# EAGLE design SMD RGB COM BC639 REV5 (EAGLE 8.5.1)
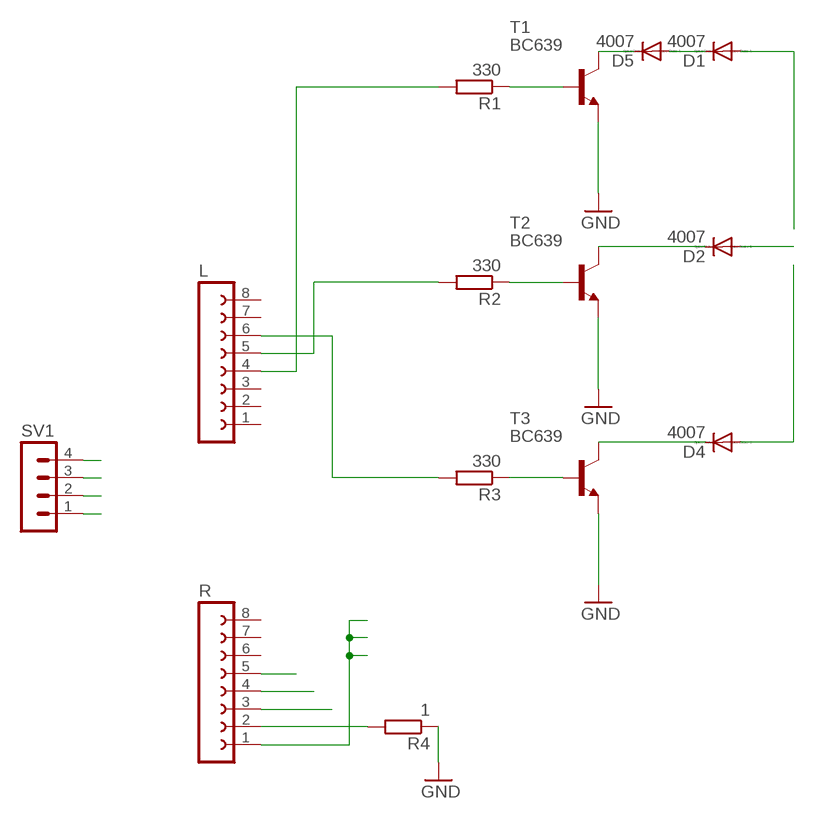
[diagram p0: schematic, sheet 1]

## Parts
D1  4007  1N4148DO35-7  [DO35-7]
D2  4007  1N4148DO35-7  [DO35-7]
D4  4007  1N4148DO35-7  [DO35-7]
D5  4007  1N4148DO35-7  [DO35-7]
L  FE08-1  [FE08]
R  FE08-1  [FE08]
R1  330  R-EU_0204/7  [0204/7]
R2  330  R-EU_0204/7  [0204/7]
R3  330  R-EU_0204/7  [0204/7]
R4  1  R-EU_0204/7  [0204/7]
SV1  MA04-1  [MA04-1]
T1  BC639  BC639-NPN-TO92-ECB  [TO92-ECB]
T2  BC639  BC639-NPN-TO92-ECB  [TO92-ECB]
T3  BC639  BC639-NPN-TO92-ECB  [TO92-ECB]

## Nets
+5V [+V]: R.1 SV1.4
BB: R3.1 T3.B
BG: R2.1 T2.B
BI: L.6 R3.2
BO [+V]: D4.A SV1.3
BR: R1.1 T1.B
GI: L.5 R2.2
GND [GND]: R4.1 T1.E T2.E T3.E
GNDIN [GND]: R4.2 R.2
GO [+V]: D2.A SV1.2
N$1: R.5
N$3: R.4
N$4: R.3
N$5 [+V]: D2.C T2.C
N$7: D1.C D5.A
N$8: D5.C T1.C
N$14 [+V]: D4.C T3.C
RI: L.4 R1.2
RO [+V]: D1.A SV1.1
Unconnected: L.1 L.2 L.3 L.7 L.8 R.6 R.7 R.8

## Library data of the parts
D1 D2 D4 D5 = diode2:1N4148: DIODE high speed (Philips)
L R = con-lsta:FE08-1: FEMALE HEADER; OC_FARNELL: unknown; OC_NEWARK: unknown
R1-R4 = rcl:R-EU_: RESISTOR, European symbol; SPICEPREFIX: R
SV1 = con-lstb:MA04-1: PIN HEADER; OC_FARNELL: unknown; OC_NEWARK: unknown
T1-T3 = transistor:*-NPN-: NPN Transistror BF959 corrected 2008.03.06

## Net classes
0 SIGNAL: width 0.61 mm, clearance 0.381 mm
1 GND: width 1.016 mm, clearance 0.254 mm
2 +V: width 1.016 mm, clearance 0.381 mm

## Board
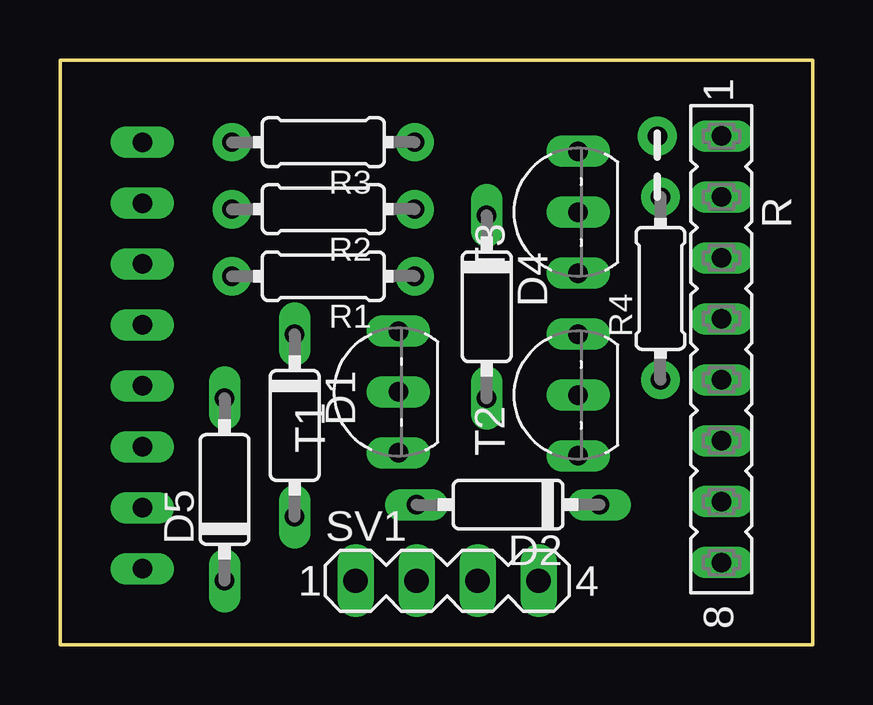
[diagram p1: board, top side]
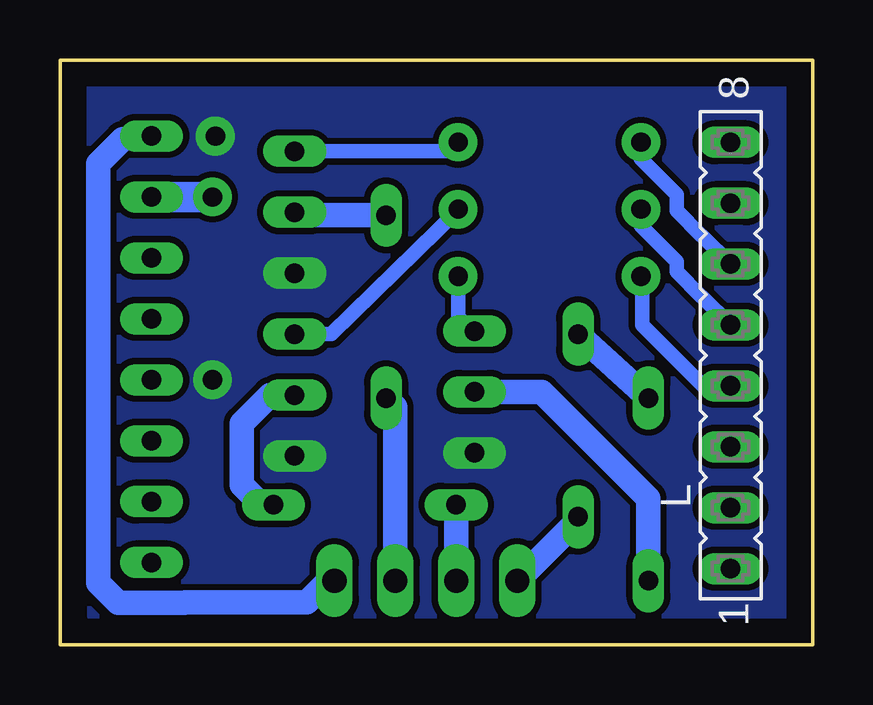
[diagram p2: board, bottom side, seen from below]

Size 31.37 x 24.38 mm. Coordinates in mm from the lower left corner, seen from the top.
Outline: 0,24.38 0,0 31.37,0 31.37,24.38 0,24.38
Copper layers (1*16): Top 0.035mm / dielectric 1.5mm / Bottom 0.035mm
Design rules "default *": minimum track width 6mil, minimum drill 0.35mm, track to track 8mil, track to pad 8mil, pad to pad 8mil, via to via 8mil, smd to smd 8mil, copper to edge 40mil, drill to drill 8mil, minimum pad ring 10mil, minimum via ring 8mil, stop-mask expansion 4mil, vias tented up to drill 0mil, thermal gap 10mil

### Footprints (pad centres in the part's own frame; a part is rotated, then mirrored left to right if it is on the bottom)
DO35-7 = drill 0.813 long: A 3.81,0; C -3.81,0
FE08 = drill 0.813 long: 1 -8.89,0; 2 -6.35,0; 3 -3.81,0; 4 -1.27,0; 5 1.27,0; 6 3.81,0; 7 6.35,0; 8 8.89,0
0204/7 = drill 0.8 pad 1.6: 1 -3.81,0; 2 3.81,0
MA04-1 = drill 1.016 long: 1 -3.81,0; 2 -1.27,0; 3 1.27,0; 4 3.81,0
TO92-ECB = drill 0.813 long: B 2.54,0; C 0,0; E -2.54,0

### Placement (x,y rotation side)
D1  9.78,9.14 270 top
D2  18.67,5.84 180 top
D4  17.78,14.1 270 top
D5  6.86,6.48 90 top
L  3.43,12.06 90 bottom
R  27.56,12.32 270 top
R1  10.97,15.37 180 top
R2  10.97,18.16 180 top
R3  10.97,20.95 180 top
R4  25.02,14.86 90 top
SV1  16.13,2.67 0 top
T1  14.1,10.54 90 top
T2  21.59,10.41 90 top
T3  21.59,18.03 90 top

### Tracks (layer width: path | path; a pad name or v marks a point on that pad's centre or on a via)
+5V
  Bottom 1.016: 28.94,1.75 26.18,1.75 26.16,1.78 21.08,1.78 20.19,2.67 SV1.4 | 28.94,1.75 29.77,2.59 29.77,3.17 29.77,20.07 28.75,21.08 R.1 | 28.94,1.75
BB
  Bottom 0.61: T3.B 15.16,20.57 R3.1
BG
  Bottom 0.61: R2.1 14.73,18.16 20.07,12.95 T2.B
BI
  Bottom 0.61: L.6 4.62,17.07 4.65,17.07 5.67,18.1 5.67,18.78 7.16,20.26 R3.2
BO
  Bottom 1.016: SV1.3 17.4,9.91 D4.A
BR
  Bottom 0.61: R1.1 14.78,13.64 T1.B
GI
  Bottom 0.61: L.5 4.62,14.53 4.65,14.53 5.67,15.56 5.67,15.98 7.16,17.47 R2.2
GND  (via drill 0.8 pad 1.63)
  other vias: 24.89,21.21
  pour Bottom (no thermals): 0.89,23.5 30.61,23.5 30.61,0.89 0.89,0.89
GNDIN
  Bottom 1.27: R4.2 R.2
GO
  Bottom 1.016: 14.86,3.56 SV1.2 D2.A
N
  pour Bottom: 7.75,1.14 30.1,1.14 30.1,23.37 1.02,23.37 1.02,5.21 1.02,1.14
N$5
  Bottom 1.016: T2.C 22.61,10.41 23.8,9.22 23.8,6.67 22.97,5.84 D2.C
N$7
  Bottom 1.016: D1.C 9.65,12.83 D5.A
N$8
  Bottom 1.016: D5.C 6.86,6.1 11.3,10.54 T1.C
N$14
  Bottom 1.016: T3.C 21.46,17.91 D4.C
RI
  Bottom 0.61: L.4 4.57,10.79 7.11,13.34 7.11,15.19 R1.2
RO
  Bottom 1.016: SV1.1 9.78,5.21 D1.A

### Text on the board
tValues: 5V | GND | D4 | DB | D3 | DG | D2 | DR | D1 | RX | TX | R | G | B
bValues: +